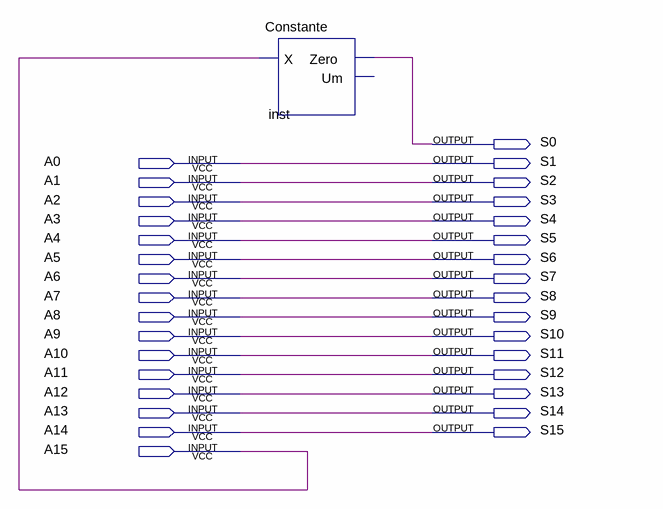
[diagram p0: schematic sheet]
// Quartus schematic UmShiftaEsquerda.bdf as structural Verilog: 1 symbols, 32 pins
module UmShiftaEsquerda (
  input  A0,
  input  A1,
  input  A2,
  input  A3,
  input  A4,
  input  A5,
  input  A6,
  input  A7,
  input  A8,
  input  A9,
  input  A10,
  input  A11,
  input  A12,
  input  A13,
  input  A14,
  input  A15,
  output S0,
  output S1,
  output S2,
  output S3,
  output S4,
  output S5,
  output S6,
  output S7,
  output S8,
  output S9,
  output S10,
  output S11,
  output S12,
  output S13,
  output S14,
  output S15
);

  Constante inst (.X(A15), .Zero(S0));  // open: Um

  assign S1 = A0;
  assign S2 = A1;
  assign S3 = A2;
  assign S4 = A3;
  assign S5 = A4;
  assign S6 = A5;
  assign S7 = A6;
  assign S8 = A7;
  assign S9 = A8;
  assign S10 = A9;
  assign S11 = A10;
  assign S12 = A11;
  assign S13 = A12;
  assign S14 = A13;
  assign S15 = A14;
endmodule
